# Altium schematic sheet 02_RPI_IO.SchDoc
size A4; Revision: A
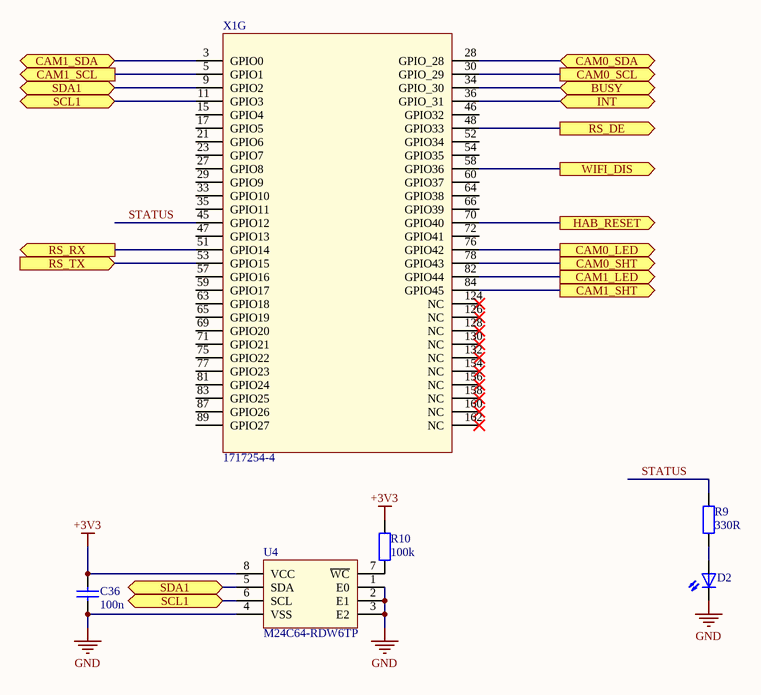
[diagram p0: 02_RPI_IO.SchDoc]

## Parts
C36  100n  [C0603_IPC_HD]
D2  LTST-C190GKT  [LED_0603]  (value not drawn)
R9  330R  [R0603_IPC_MD]
R10  100k  [R0603_IPC_MD]
U4  M24C64-RDW6TP  [TSSOP8_(ST)]
X1  1717254-4  [1717254-1]  (part G of 7)

## Ports
BUSY (bidir), CAM0_LED (out), CAM0_SCL (out), CAM0_SDA (bidir), CAM0_SHT (out), CAM1_LED (out), CAM1_SCL (out), CAM1_SDA (bidir), CAM1_SHT (out), HAB_RESET (out), INT (bidir), RS_DE (out), RS_RX (out), RS_TX (in), SCL1 (bidir), SDA1 (bidir), WIFI_DIS (out)

## Nets
+3V3: C36.2 R10.2 U4.8(VCC)
GND: C36.1 D2.1(C) U4.1(E0) U4.2(E1) U4.3(E2) U4.4(VSS)
BUSY: X1.34(GPIO_30) ; port BUSY
CAM0_LED: X1.76(GPIO42) ; port CAM0_LED
CAM0_SCL: X1.30(GPIO_29) ; port CAM0_SCL
CAM0_SDA: X1.28(GPIO_28) ; port CAM0_SDA
CAM0_SHT: X1.78(GPIO43) ; port CAM0_SHT
CAM1_LED: X1.82(GPIO44) ; port CAM1_LED
CAM1_SCL: X1.5(GPIO1) ; port CAM1_SCL
CAM1_SDA: X1.3(GPIO0) ; port CAM1_SDA
CAM1_SHT: X1.84(GPIO45) ; port CAM1_SHT
HAB_RESET: X1.70(GPIO40) ; port HAB_RESET
INT: X1.36(GPIO_31) ; port INT
RS_DE: X1.48(GPIO33) ; port RS_DE
RS_RX: X1.51(GPIO14) ; port RS_RX
RS_TX: X1.53(GPIO15) ; port RS_TX
SCL1: U4.6(SCL) X1.11(GPIO3) ; port SCL1
SDA1: U4.5(SDA) X1.9(GPIO2) ; port SDA1
STATUS: R9.2 X1.45(GPIO12)
WIFI_DIS: X1.58(GPIO36) ; port WIFI_DIS
NetD2_2: D2.2(A) R9.1
NetR10_1: R10.1 U4.7(~{WC})

Not connected (* = marked no-connect by the designer): X1 15(GPIO4) 17(GPIO5) 21(GPIO6) 23(GPIO7) 27(GPIO8) 29(GPIO9) 33(GPIO10) 35(GPIO11) 46(GPIO32) 47(GPIO13) 52(GPIO34) 54(GPIO35) 57(GPIO16) 59(GPIO17) 60(GPIO37) 63(GPIO18) 64(GPIO38) 65(GPIO19) 66(GPIO39) 69(GPIO20) 71(GPIO21) 72(GPIO41) 75(GPIO22) 77(GPIO23) 81(GPIO24) 83(GPIO25) 87(GPIO26) 89(GPIO27) 124(NC)* 126(NC)* 128(NC)* 130(NC)* 132(NC)* 154(NC)* 156(NC)* 158(NC)* 160(NC)* 162(NC)*

## Notes on the sheet
- Title
- Size:
- Date:
- A4
- Number:
- Time:
- Revision:
- Sheet
- of
- File:

## Library data of the parts
C36 = CL10B104KO8NNNC: CAP CER 0.1UF 16V X7R 0603; Manufacturer: Samsung Electro-Mechanics; Manufacturer Part Number: CL10B104KO8NNNC; Voltage: 16V; Value: 100n; Dielectric: X7R; Supplier 1: Digi-Key; Supplier Part Number 1: 1276-1005-1-ND
D2 = LTST-C190GKT: LED GREEN CLEAR CHIP SMD 0603; Manufacturer: Lite-On Inc.; Manufacturer Part Number: LTST-C190GKT; Color: Green; Supplier 1: Digi-Key; Supplier Part Number 1: 160-1183-1-ND
R9 = CR0603-JW-331ELF: RES SMD 330 OHM 5% 1/10W 0603; Manufacturer: Bourns Inc.; Value: 330R; Tolarance: 5%; Manufacturer Part Number: CR0603-JW-331ELF; Supplier 1: Digi-Key; Supplier Part Number 1: CR0603-JW-331ELFCT-ND
R10 = RMCF0603FT100K: RES 100K OHM 1% 1/10W 0603; Manufacturer: Bourns Inc.; Value: 100k; Tolarance: 1%; Manufacturer Part Number: RMCF0603FT100K; Supplier 1: Digi-Key; Supplier Part Number 1: RMCF0603FT100KCT-ND
U4 = M24C64-RDW6TP: IC EEPROM 64K I2C 1MHZ 8TSSOP; Manufacturer: STMicroelectronics; Manufacturer Part Number: M24C64-RDW6TP; Supplier 1: Digi-Key; Supplier Part Number 1: 497-8647-1-ND
X1 = Raspberry CM Connector: CONN SKT SODIMM 200POS R/A SMD; Manufacturer: TE Connectivity AMP Connectors; Manufacturer Part Number: 1717254-4; Supplier 1: Digi-Key; Supplier Part Number 1: A130932CT-ND